# EAGLE design Breaduino-V1 (EAGLE 6.0)
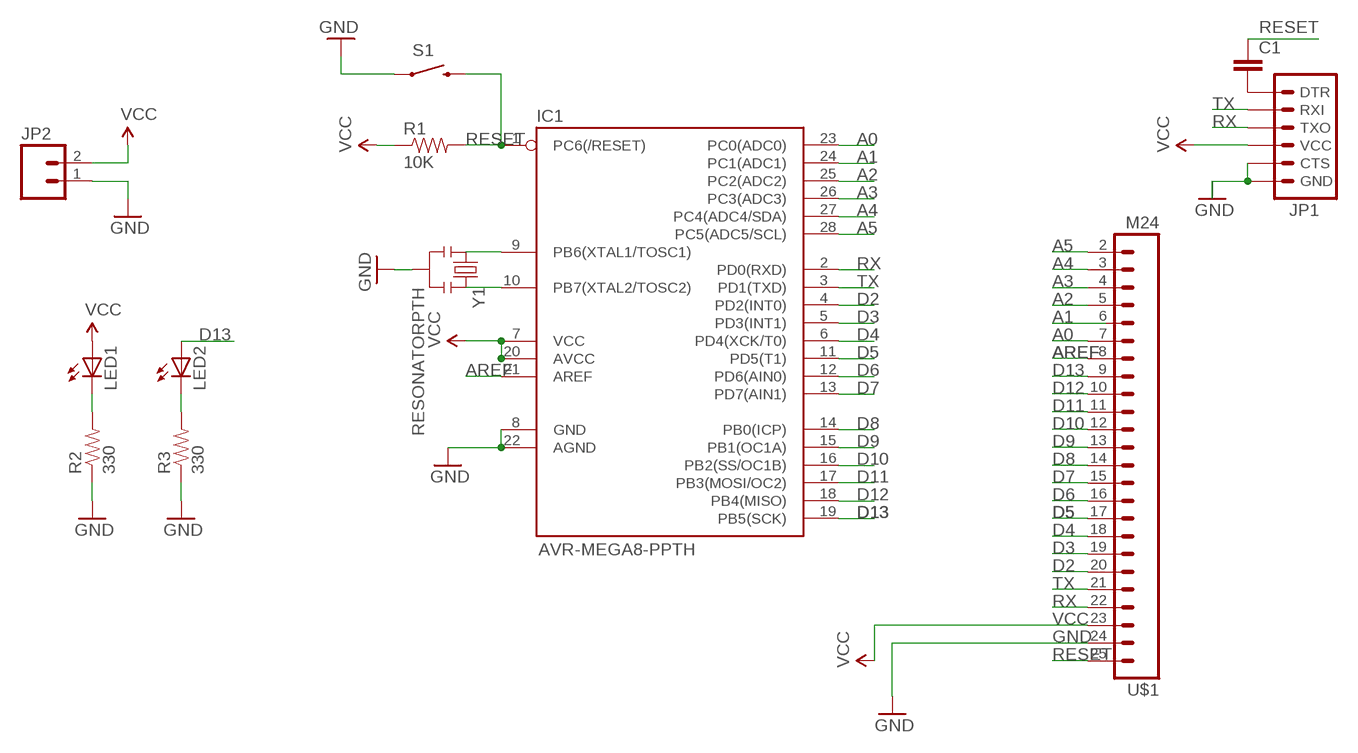
[diagram p0: schematic, sheet 1]

## Parts
C1  CAPPTH  [CAP-PTH-SMALL]
IC1  AVR-MEGA8-PPTH  [DIL28-3]
JP1  ARDUINO_SERIAL_PROGRAMPTH  [1X06]
JP2  M02JST-PTH-2  [JST-2-PTH]
LED1  LED3MM  [LED3MM]
LED2  LED3MM  [LED3MM]
R1  10K  RESISTORAXIAL-0.3  [AXIAL-0.3]
R2  330  RESISTORAXIAL-0.3  [AXIAL-0.3]
R3  330  RESISTORAXIAL-0.3  [AXIAL-0.3]
S1  SWITCH-MOMENTARY-2PTH  [TACTILE-PTH]
U$1  M24  [1X24]
Y1  RESONATORPTH  [RESONATOR-PTH]

## Nets
A0: IC1.23(PC0(ADC0)) U$1.7
A1: IC1.24(PC1(ADC1))
A2: IC1.25(PC2(ADC2)) U$1.5
A3: IC1.26(PC3(ADC3)) U$1.4
A4: IC1.27(PC4(ADC4/SDA)) U$1.3
A5: IC1.28(PC5(ADC5/SCL)) U$1.2
AREF: IC1.21(AREF) U$1.8
D2: IC1.4(PD2(INT0)) U$1.20
D3: IC1.5(PD3(INT1)) U$1.19
D4: IC1.6(PD4(XCK/T0)) U$1.18
D5: IC1.11(PD5(T1)) U$1.17
D6: IC1.12(PD6(AIN0)) U$1.16
D7: IC1.13(PD7(AIN1)) U$1.15
D8: IC1.14(PB0(ICP)) U$1.14
D9: IC1.15(PB1(OC1A)) U$1.13
D10: IC1.16(PB2(SS/OC1B)) U$1.12
D11: IC1.17(PB3(MOSI/OC2)) U$1.11
D12: IC1.18(PB4(MISO)) U$1.10
D13: IC1.19(PB5(SCK)) LED2.A U$1.9
GND: IC1.8(GND) JP1.5(CTS) JP1.6(GND) JP2.1 R2.P$1 R3.P$1 S1.1 U$1.24 Y1.2
N$1: LED1.K(C) R2.P$2
N$2: LED2.K(C) R3.P$2
N$5: IC1.22(AGND)
N$6: IC1.9(PB6(XTAL1/TOSC1)) Y1.1
N$7: IC1.10(PB7(XTAL2/TOSC2)) Y1.3
N$10: C1.2 JP1.1(DTR)
RESET: C1.1 IC1.1(PC6(/RESET)) R1.P$2 S1.3 U$1.25
RX: IC1.2(PD0(RXD)) JP1.3(TXO) U$1.22
TX: IC1.3(PD1(TXD)) JP1.2(RXI) U$1.21
VCC: IC1.7(VCC) IC1.20(AVCC) JP1.4(VCC) JP2.2 LED1.A R1.P$1 U$1.23
Unconnected: U$1.6

## Library data of the parts
C1 = SFE Passives:CAP: Capacitor Standard 0603 ceramic capacitor, and 0.1" leaded capacitor.
IC1 = SFE DigitalIC:AVR-MEGA8-P: MICROCONTROLLER 8 Kbytes FLASH 1 kbytes SRAM 512 bytes EEPROM USART 4-channel 10 bit ADC 2-channel 8 bit ADC
JP1 = SFE Connectors:ARDUINO_SERIAL_PROGRAM: FTDI connector footprints
JP2 = SFE Connectors:M02: Header 2 Standard 2-pin 0.1" header. Use with straight break away headers (SKU : PRT-00116), right angle break away headers (PRT-00553), swiss pins (PRT-00743), machine pins (PRT-00117), and female headers (PRT-00115). Molex polarized connector foot print use with SKU : PRT-08233 with associated crimp pins and housings.
LED1 LED2 = SFE LED:LED: LEDs Standard schematic elements and footprints for 5mm, 3mm, 1206, and 0603 sized LEDs. 5mm - Spark Fun Electronics SKU : COM-00529 (and others)
R1-R3 = SFE Passives:RESISTOR: Resistor Basic schematic elements and footprints for 0603, 1206, and PTH resistors.
S1 = SFE Electromechanical:SWITCH-MOMENTARY-2: Various NO switches- pushbuttons, reed, etc
U$1 = SFE Connectors:M24: 1x24 .1" header
Y1 = SFE FreqCtrl:RESONATOR: Resonator Small SMD resonator. This is the itty bitty 10/20MHz resonators with built in caps. CSTCE10M0G55 and CSTCE20M0V53. Footprint has been reviewed closely but hasn't been tested yet.

## Board
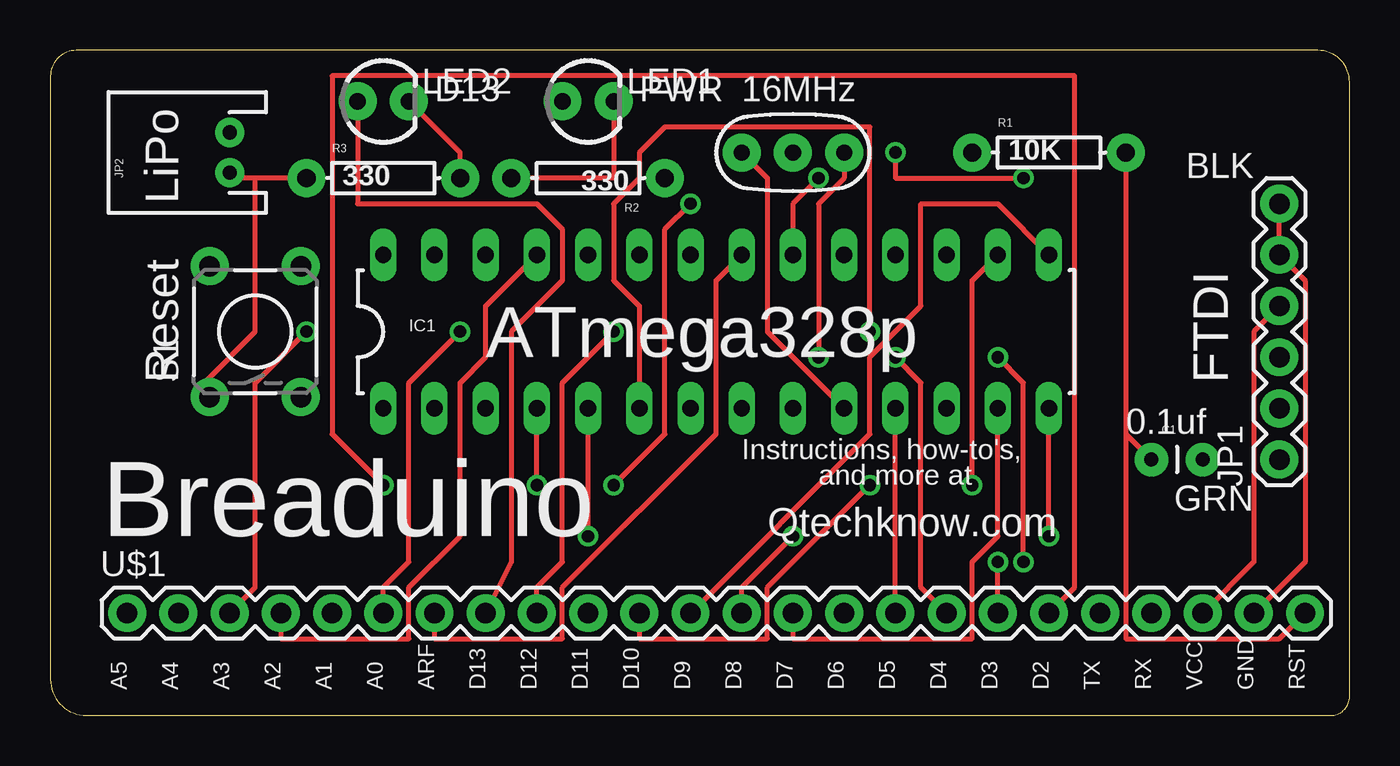
[diagram p1: board, top side]
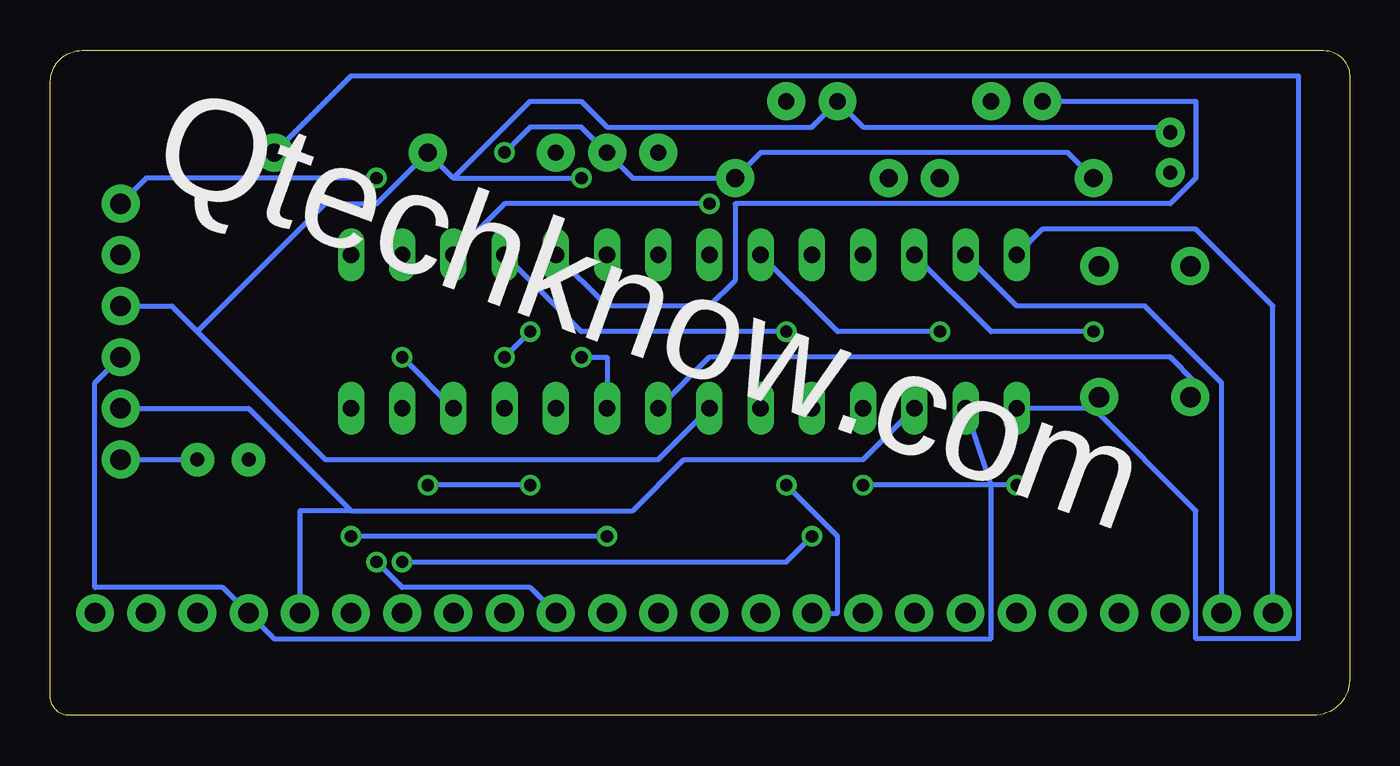
[diagram p2: board, bottom side, seen from below]

Size 64.44 x 33.01 mm. Coordinates in mm from the lower left corner, seen from the top.
Outline: 62.87,33.01 1.28,33.01 arc90 0,31.73 0,1.8 arc90 1.8,0 63.5,0 arc90 64.44,0.94 64.44,31.44 arc90 62.87,33.01
Copper layers (1*16): Top 0.035mm / dielectric 1.5mm / Bottom 0.035mm
Design rules: minimum track width 10mil, minimum drill 24mil, track to track 8mil, track to pad 8mil, pad to pad 8mil, via to via 8mil, smd to smd 8mil, copper to edge 40mil, drill to drill 8mil, minimum pad ring 10mil, minimum via ring 8mil, stop-mask expansion 4mil, vias tented up to drill 0mil, thermal gap 10mil

### Footprints (pad centres in the part's own frame; a part is rotated, then mirrored left to right if it is on the bottom)
CAP-PTH-SMALL = drill 0.7 pad 1.651: 1 0,0; 2 2.54,0
DIL28-3 = drill 0.813 long: 1 -16.51,-3.81; 2 -13.97,-3.81; 3 -11.43,-3.81; 4 -8.89,-3.81; 5 -6.35,-3.81; 6 -3.81,-3.81; 7 -1.27,-3.81; 8 1.27,-3.81; 9 3.81,-3.81; 10 6.35,-3.81; 11 8.89,-3.81; 12 11.43,-3.81; 13 13.97,-3.81; 14 16.51,-3.81; 15 16.51,3.81; 16 13.97,3.81; 17 11.43,3.81; 18 8.89,3.81; 19 6.35,3.81; 20 3.81,3.81; 21 1.27,3.81; 22 -1.27,3.81; 23 -3.81,3.81; 24 -6.35,3.81; 25 -8.89,3.81; 26 -11.43,3.81; 27 -13.97,3.81; 28 -16.51,3.81
1X06 = drill 1.016 pad 1.88: 1 0,0; 2 2.54,0; 3 5.08,0; 4 7.62,0; 5 10.16,0; 6 12.7,0
JST-2-PTH = drill 0.7 pad 1.448: 1 -1,0; 2 1,0
LED3MM = drill 0.813 pad 1.88: A -1.27,0; K 1.27,0
AXIAL-0.3 = drill 0.9 pad 1.88: P$1 -3.81,0; P$2 3.81,0
TACTILE-PTH = drill 1.016 pad 1.88: 1 -3.251,2.261; 2 3.251,2.261; 3 -3.251,-2.261; 4 3.251,-2.261
1X24 = drill 1.016 pad 1.88: 2 -26.67,0; 3 -24.13,0; 4 -21.59,0; 5 -19.05,0; 6 -16.51,0; 7 -13.97,0; 8 -11.43,0; 9 -8.89,0; 10 -6.35,0; 11 -3.81,0; 12 -1.27,0; 13 1.27,0; 14 3.81,0; 15 6.35,0; 16 8.89,0; 17 11.43,0; 18 13.97,0; 19 16.51,0; 20 19.05,0; 21 21.59,0; 22 24.13,0; 23 26.67,0; 24 29.21,0; 25 31.75,0
RESONATOR-PTH = drill 0.8 pad 1.88: 1 -2.54,0; 2 0,0; 3 2.54,0

### Placement (x,y rotation side)
C1  54.61,12.7 0 top
IC1  33.02,19.05 0 top
JP1  60.96,12.7 90 top
JP2  8.89,27.94 90 top
LED1  26.67,30.48 0 top
LED2  16.51,30.48 0 top
R1  49.53,27.94 0 top
R2  26.67,26.67 180 top
R3  16.51,26.67 0 top
S1  10.16,19.05 90 top
U$1  30.48,5.08 0 top
Y1  36.83,27.94 180 top

### Tracks (layer width: path | path; a pad name or v marks a point on that pad's centre or on a via)
A0  (via drill 0.61)
  Top 0.254: v20.32,19.05 17.78,16.51 17.78,7.62 16.51,6.35 U$1.7
  Bottom 0.254: IC1.23 25.4,19.05 v20.32,19.05
A2
  Top 0.254: IC1.25 21.59,20.32 21.59,17.78 20.32,16.51 20.32,8.89 17.78,6.35 17.78,3.81 11.43,3.81 U$1.5
A3  (via drill 0.61)
  Top 0.254: v12.7,19.05 10.16,16.51 10.16,6.35 U$1.4
  Bottom 0.254: IC1.26 17.78,19.05 v12.7,19.05
A4
  Bottom 0.254: IC1.27 16.51,20.32 10.16,20.32 6.35,16.51 U$1.3
A5
  Bottom 0.254: IC1.28 15.24,24.13 7.62,24.13 3.81,20.32 U$1.2
AREF
  Top 0.254: IC1.21 33.02,21.59 33.02,13.97 25.4,6.35 25.4,3.81 19.05,3.81 U$1.8
D2  (via drill 0.61)
  Top 0.254: v24.13,11.43 IC1.4 | v16.51,11.43 13.97,13.97 13.97,31.75 50.8,31.75 50.8,6.35 U$1.20
  Bottom 0.254: v16.51,11.43 v24.13,11.43
D3  (via drill 0.61)
  Top 0.254: v26.67,8.89 IC1.5 | U$1.19 v46.99,7.62
  Bottom 0.254: v26.67,8.89 27.94,7.62 v46.99,7.62
D4  (via drill 0.61)
  Top 0.254: IC1.6 29.21,20.32 27.94,21.59 27.94,25.4 29.21,26.67 29.21,27.94 30.48,29.21 40.64,29.21 v40.64,19.05 | v41.91,17.78 43.18,16.51 43.18,6.35 U$1.18
  Bottom 0.254: v41.91,17.78 v40.64,19.05
D5
  Top 0.254: U$1.17 IC1.11
D6  (via drill 0.61)
  Top 0.254: v46.99,17.78 48.26,16.51 v48.26,7.62
  Bottom 0.254: v46.99,17.78 IC1.12 | v48.26,7.62 46.99,6.35 40.64,6.35 U$1.16
D7
  Top 0.254: IC1.13 46.99,8.89 45.72,7.62 45.72,3.81 36.83,3.81 U$1.15
D8  (via drill 0.61)
  Top 0.254: v49.53,8.89 IC1.14 | v36.83,8.89 34.29,6.35 U$1.14
  Bottom 0.254: v36.83,8.89 v49.53,8.89
D9
  Top 0.254: IC1.15 46.99,25.4 43.18,25.4 43.18,20.32 40.64,17.78 40.64,13.97 U$1.13
D10  (via drill 0.61)
  Top 0.254: IC1.16 45.72,21.59 v45.72,11.43 | v40.64,11.43 35.56,6.35 35.56,3.81 29.21,3.81 U$1.12
  Bottom 0.254: v40.64,11.43 v45.72,11.43
D11  (via drill 0.61)
  Top 0.254: v31.75,25.4 30.48,24.13 30.48,13.97 v27.94,11.43
  Bottom 0.254: IC1.17 41.91,25.4 v31.75,25.4 | v27.94,11.43 25.4,8.89 25.4,5.08 U$1.11
D12  (via drill 0.61)
  Top 0.254: v27.94,19.05 25.4,16.51 25.4,7.62 24.13,6.35 U$1.10
  Bottom 0.254: IC1.18 38.1,19.05 v27.94,19.05
D13
  Top 0.254: U$1.9 22.86,7.62 22.86,19.05 25.4,21.59 25.4,24.13 24.13,25.4 15.24,25.4 LED2.A
  Bottom 0.254: IC1.19 36.83,20.32 31.75,20.32 30.48,21.59 30.48,25.4 8.89,25.4 7.62,26.67 7.62,30.48 LED2.A
GND  (via drill 0.61)
  Top 0.254: U$1.24 62.23,7.62 62.23,21.59 JP1.5 JP1.6 | R3.P$1 10.16,26.67 | 10.16,26.67 8.89,26.67 JP2.1 | 10.16,26.67 10.16,19.05 7.62,16.51 S1.1 | v48.26,26.67 41.91,26.67 v41.91,27.94
  Bottom 0.254: IC1.8 31.75,17.78 8.89,17.78 7.62,16.51 S1.1 | R3.P$1 13.97,27.94 29.21,27.94 R2.P$1 35.56,26.67 Y1.2 38.1,29.21 40.64,29.21 v41.91,27.94 | JP1.6 59.69,26.67 v48.26,26.67
N$1
  Top 0.254: R2.P$2 27.94,26.67 LED1.K
N$2
  Top 0.254: LED2.K 20.32,27.94 R3.P$2
N$6  (via drill 0.61)
  Top 0.254: v38.1,17.78 38.1,25.4 39.37,26.67 Y1.1
  Bottom 0.254: IC1.9 36.83,17.78 v38.1,17.78
N$7
  Top 0.254: IC1.10 35.56,19.05 35.56,26.67 Y1.3
N$10
  Bottom 0.254: JP1.1 C1.2
RESET
  Top 0.254: 53.34,13.97 C1.1 | R1.P$2 53.34,13.97 | U$1.25 60.96,3.81 53.34,3.81 53.34,13.97
  Bottom 0.254: 12.7,15.24 IC1.1 | 12.7,15.24 7.62,10.16 7.62,3.81 2.54,3.81 2.54,31.75 49.53,31.75 R1.P$2 | 12.7,15.24 S1.3
RX
  Bottom 0.254: IC1.2 17.78,11.43 17.78,3.81 53.34,3.81 U$1.22 55.88,6.35 62.23,6.35 62.23,16.51 JP1.3
TX
  Bottom 0.254: IC1.3 24.13,12.7 33.02,12.7 35.56,10.16 49.53,10.16 | 49.53,10.16 54.61,15.24 JP1.2 | U$1.21 52.07,10.16 49.53,10.16
VCC  (via drill 0.61)
  Top 0.254: IC1.20 36.83,25.4 v38.1,26.67 | U$1.23 59.69,7.62 59.69,19.05 JP1.4
  Bottom 0.254: JP2.2 8.89,29.21 24.13,29.21 LED1.A 26.67,29.21 36.83,29.21 38.1,30.48 40.64,30.48 44.45,26.67 | 44.45,26.67 v38.1,26.67 | 44.45,26.67 R1.P$1 48.26,25.4 50.8,25.4 57.15,19.05 | IC1.7 34.29,12.7 50.8,12.7 57.15,19.05 | 57.15,19.05 58.42,20.32 JP1.4

### Text on the board
tPlace: D13 | PWR | 16MHz | BLK | LiPo | ATmega328p | Reset | FTDI | 0.1uf | Instructions, how-to's, | and more at | GRN | Breaduino | Qtechknow.com | A5 | A4 | A3 | A2 | A1 | A0 | ARF | D13 | D12 | D11 | D10 | D9 | D8 | D7 | D6 | D5 | D4 | D3 | D2 | TX | RX | VCC | GND | RST
bPlace: Qtechknow.com